# EAGLE design MODUL_TEMPERATURE_V100 (EAGLE 6.4)
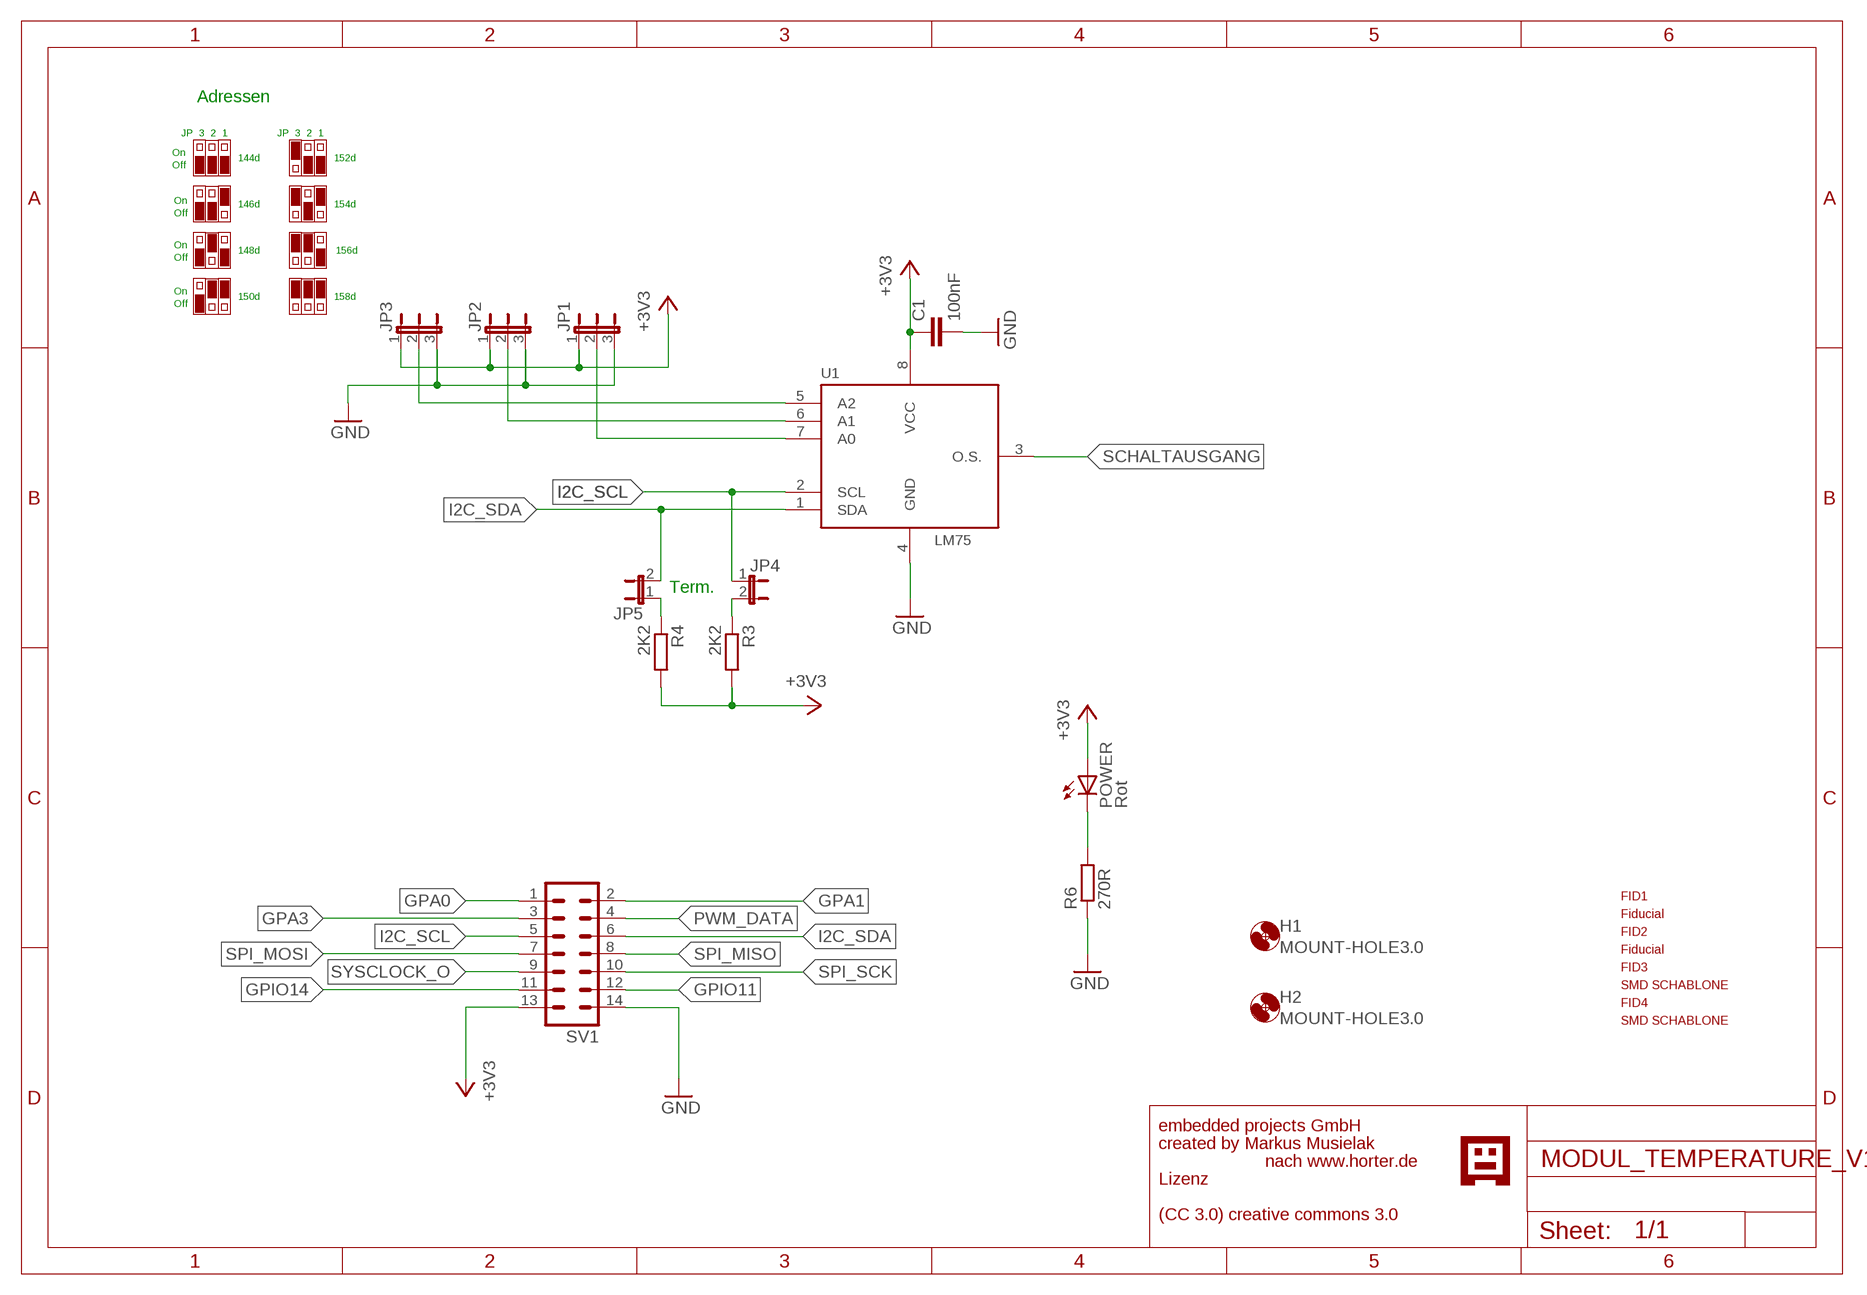
[diagram p0: schematic, sheet 1]

## Parts
C1  100nF  C-EUC0805  [C0805]
FID1  PASSERMARKEN_FIDUCIAL  [PASSERMARKEN_FIDUCIAL]
FID2  PASSERMARKEN_FIDUCIAL  [PASSERMARKEN_FIDUCIAL]
FID3  PASSERMARKEN_FIDUCIAL  [PASSERMARKEN_FIDUCIAL]
FID4  PASSERMARKEN_FIDUCIAL  [PASSERMARKEN_FIDUCIAL]
H1  MOUNT-HOLE3.0  [3,0]
H2  MOUNT-HOLE3.0  [3,0]
JP1  JP2E  [JP2]
JP2  JP2E  [JP2]
JP3  JP2E  [JP2]
JP4  JP1E  [JP1]
JP5  JP1E  [JP1]
POWER  Rot  LEDCHIP-LED0805  [CHIP-LED0805]
R3  2K2  R-EU_R0805  [R0805]
R4  2K2  R-EU_R0805  [R0805]
R6  270R  R-EU_R0805  [R0805]
SV1  ML14  [ML14]
U1  LM75  [SO-8]
U$1  GNUBLINLOGOSIEB  [GNUSIEBDRUCK]

## Nets
+3V3: C1.1 JP1.1 JP2.1 JP3.1 POWER.A R3.2 R4.2 SV1.13 U1.8(VCC)
GND: C1.2 JP1.3 JP2.3 JP3.3 R6.1 SV1.14 U1.4(GND)
GPA0: SV1.1
GPA1: SV1.2
GPA3: SV1.3
GPIO11: SV1.12
GPIO14: SV1.11
I2C_SCL: JP4.1 SV1.5 U1.2(SCL)
I2C_SDA: JP5.2 SV1.6 U1.1(SDA)
N$1: JP1.2 U1.7(A0)
N$2: JP2.2 U1.6(A1)
N$3: JP3.2 U1.5(A2)
N$6: JP4.2 R3.1
N$7: JP5.1 R4.1
N$9: POWER.C R6.2
PWM_DATA: SV1.4
SCHALTAUSGANG: U1.3(O.S.)
SPI_MISO: SV1.8
SPI_MOSI: SV1.7
SPI_SCK: SV1.10
SYSCLOCK_O: SV1.9

## Notes on the sheet
- Adressen
- JP  3  2  1 | JP  3  2  1
- On
- 144d | 152d
- Off
- On
- 146d | 154d
- Off
- On
- 148d | 156d
- Off
- On
- 150d | 158d
- Off
- Term.
- embedded projects GmbH
- created by Markus Musielak
- nach www.horter.de
- Lizenz
- (CC 3.0) creative commons 3.0

## Library data of the parts
C1 = rcl:C-EU: CAPACITOR, European symbol
FID1 FID2 = KUBUS3:PASSERMARKEN_FIDUCIAL: SMD Passermarke
FID3 FID4 = SMDSCHABLONE:PASSERMARKEN_FIDUCIAL: SMD Passermarke
H1 H2 = holes:MOUNT-HOLE: MOUNTING HOLE with drill center marker
JP1-JP3 = jumper:JP2E: JUMPER
JP4 JP5 = jumper:JP1E: JUMPER
POWER = led:LED: LED OSRAM: - CHIPLED LG R971, LG N971, LY N971, LG Q971, LY Q971, LO R971, LY R971 LH N974, LH R974 LS Q976, LO Q976, LY Q976 LO Q996 - Hyper CHIPLED LW Q18S LB Q993, LB Q99A, LB R99A - SideLED LS A670, LO A670, LY A670, LG A670, LP A670 LB A673, LV A673, LT A673, LW A673 LH A674 LY A675 LS A676, LA A676, LO A676, LY A676, LW A676 LS A679, LY A679, LG A679 - Hyper Micro SIDELED® LS Y876, LA Y876, LO Y876, LY Y876 LT Y87S - SmartLED LW L88C, LW L88S LB L89C, LB L89S, LG L890 LS L89K, LO L89K, LY L89K LS L896, LA L896, LO L896, LY L896 - TOPLED LS T670, LO T670, LY T670, LG T670, LP T670 LSG T670, LSP T670, LSY T670, LOP T670, LYG T670 LG T671, LOG T671, LSG T671 LB T673, LV T673, LT T673, LW T673 LH T674 LS T676, LA T676, LO T676, LY T676, LB T676, LH T676, LSB T676, LW T676 LB T67C, LV T67C, LT T67C, LS T67K, LO T67K, LY T67K, LW E67C LS E67B, LA E67B, LO E67B, LY E67B, LB E67C, LV E67C, LT E67C LW T67C LS T679, LY T679, LG T679 LS T770, LO T770, LY T770, LG T770, LP T770 LB T773, LV T773, LT T773, LW T773 LH T774 LS E675, LA E675, LY E675, LS T675 LS T776, LA T776, LO T776, LY T776, LB T776 LHGB T686 LT T68C, LB T68C - Hyper Mini TOPLED® LB M676 - Mini TOPLED Santana® LG M470 LS M47K, LO M47K, LY M47K Source: http://www.osram.convergy.de LUXEON: - LUMILED® LXK2-PW12-R00, LXK2-PW12-S00, LXK2-PW14-U00, LXK2-PW14-V00 LXK2-PM12-R00, LXK2-PM12-S00, LXK2-PM14-U00 LXK2-PE12-Q00, LXK2-PE12-R00, LXK2-PE12-S00, LXK2-PE14-T00, LXK2-PE14-U00 LXK2-PB12-K00, LXK2-PB12-L00, LXK2-PB12-M00, LXK2-PB14-N00, LXK2-PB14-P00, LXK2-PB14-Q00 LXK2-PR12-L00, LXK2-PR12-M00, LXK2-PR14-Q00, LXK2-PR14-R00 LXK2-PD12-Q00, LXK2-PD12-R00, LXK2-PD12-S00 LXK2-PH12-R00, LXK2-PH12-S00 LXK2-PL12-P00, LXK2-PL12-Q00, LXK2-PL12-R00 Source: www.luxeon.com KINGBRIGHT: KA-3528ASYC Source: www.kingbright.com
R3 R4 R6 = rcl:R-EU_: RESISTOR, European symbol
SV1 = con-ml:ML14: HARTING; OC_FARNELL: unknown; OC_NEWARK: unknown
U1 = Sensors:LM75: I²C Temperatur Sensor; FARNELL: 1699380
U$1 = EmbeddedProjectsLogos2:GNUBLINLOGO

## Board
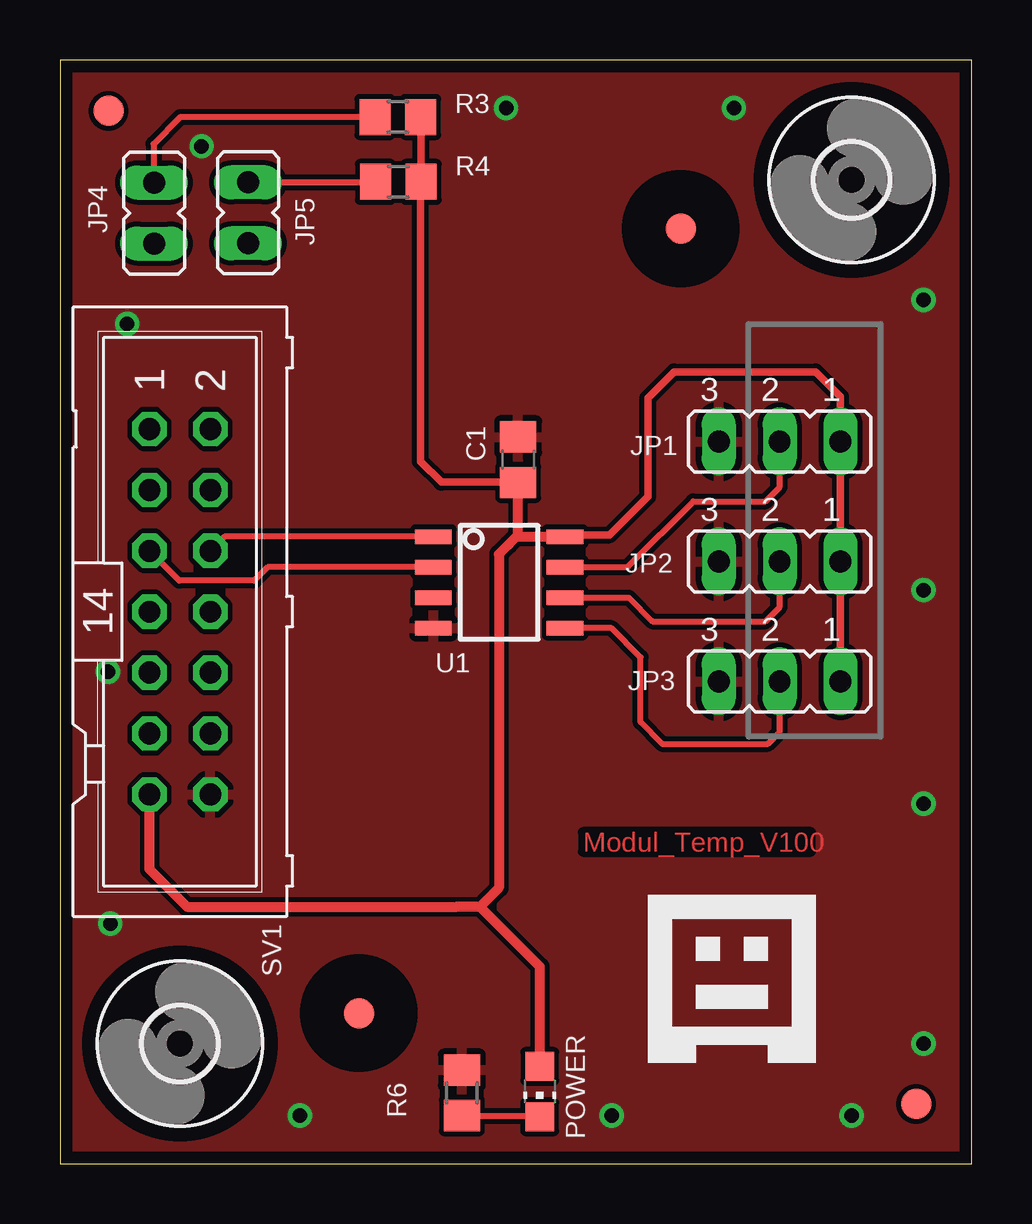
[diagram p1: board, top side]
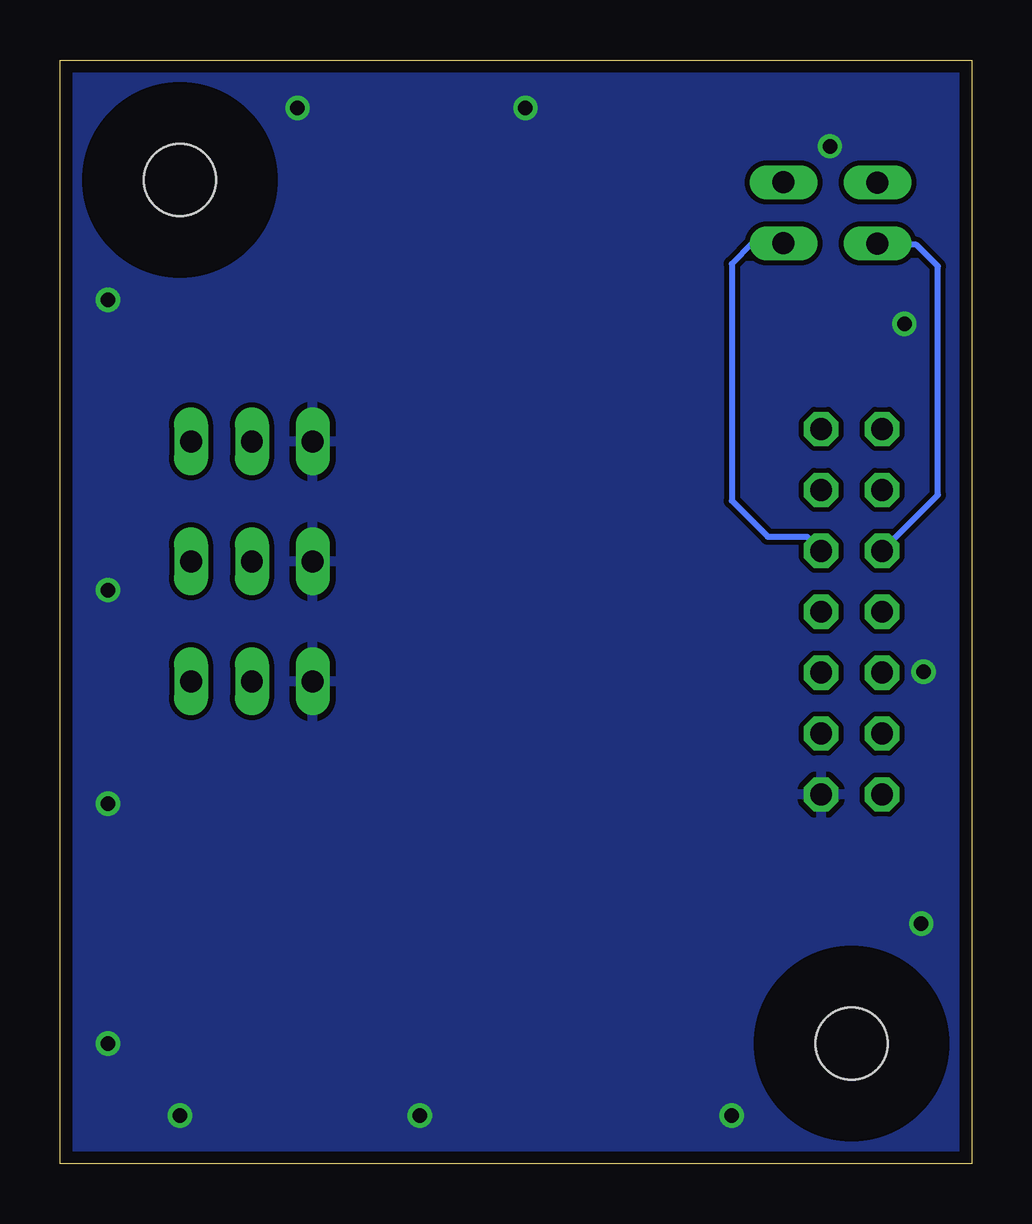
[diagram p2: board, bottom side, seen from below]

Size 38 x 46 mm. Coordinates in mm from the lower left corner, seen from the top.
Outline: 0,0 38,0 38,46 0,46 0,0
Copper layers (1*16): Top 0.035mm / dielectric 1.5mm / Bottom 0.035mm
Design rules "default *": minimum track width 10mil, minimum drill 24mil, track to track 8mil, track to pad 8mil, pad to pad 8mil, via to via 8mil, smd to smd 8mil, copper to edge 20mil, drill to drill 8mil, minimum pad ring 10mil, minimum via ring 8mil, stop-mask expansion 4mil, vias tented up to drill 40mil, thermal gap 10mil

### Footprints (pad centres in the part's own frame; a part is rotated, then mirrored left to right if it is on the bottom)
C0805 = smd 1.3 x 1.5: 1 -0.95,0; 2 0.95,0
PASSERMARKEN_FIDUCIAL = smd 1.27 x 1.27: 1 0,0
3,0 = hole 3: 0,0
JP2 = drill 0.914 long: 1 -2.54,0; 2 0,0; 3 2.54,0
JP1 = drill 0.914 long: 1 0,-1.27; 2 0,1.27
CHIP-LED0805 = smd 1.2 x 1.2: A 0,-1.05; C 0,1.05
R0805 = smd 1.3 x 1.5: 1 -0.95,0; 2 0.95,0
ML14 = drill 0.914 octagon: 1 -7.62,-1.27; 2 -7.62,1.27; 3 -5.08,-1.27; 4 -5.08,1.27; 5 -2.54,-1.27; 6 -2.54,1.27; 7 0,-1.27; 8 0,1.27; 9 2.54,-1.27; 10 2.54,1.27; 11 5.08,-1.27; 12 5.08,1.27; 13 7.62,-1.27; 14 7.62,1.27
SO-8 = smd 0.61 x 1.524: 1 -1.27,-2.743; 2 0,-2.743; 3 1.27,-2.743; 4 2.54,-2.743; 5 2.54,2.743; 6 1.27,2.743; 7 0,2.743; 8 -1.27,2.743

### Placement (x,y rotation side)
C1  19.1,29.34 90 top
FID1  12.46,6.27 0 top
FID2  25.88,38.97 0 top
FID3  2.03,43.88 0 top
FID4  35.69,2.48 0 top
H1  5,5 0 top
H2  33,41 0 top
JP1  30,30.1 180 top
JP2  30,25.1 180 top
JP3  30,20.1 180 top
JP4  3.92,39.62 0 top
JP5  7.84,39.63 180 top
POWER  20,3 180 top
R3  14.08,43.62 0 top
R4  14.1,40.92 0 top
R6  16.75,2.95 270 top
SV1  5,23 270 top
U1  18.31,24.86 270 top
U$1  24.5,4.2 0 top

### Tracks (layer width: path | path; a pad name or v marks a point on that pad's centre or on a via)
+3V3
  Top 0.254: 15.03,40.9 R4.2 | 15.05,43.6 R3.2
  Top 0.305: C1.1 18.39,28.4 15.9,28.4 15.03,29.27 15.03,40.9 | JP3.1 JP2.1 JP1.1 32.54,31.96 31.5,33 25.6,33 24.5,31.9 24.5,27.8 22.9,26.2 21.12,26.2 U1.8 | R4.2 15.05,43.6
  Top 0.406: SV1.13 3.73,12.27 5.3,10.7 16.55,10.7 17.5,10.7 | U1.8 19.03,26.13 18.7,25.8 | 18.7,25.8 18.3,25.4 18.3,11.5 17.5,10.7 | C1.1 19.1,26.2 18.7,25.8 | POWER.A 20,8.2 17.5,10.7
GND  (via drill 0.6)
  other vias: 10,2 23,2 33,2 36,5 36,15 36,23.9 36,36 28.1,44 18.6,44 2.1,10 2,20.5 2.8,35 5.9,42.4
  pour Bottom: -1.6,-2.6 40.6,-2.6 40.6,48.8 -1.7,48.8 -1.7,-2.6
  pour Top: -1.3,48.5 40.1,48.5 40.1,-2.1 -1.3,-2.1
I2C_SCL
  Top 0.254: U1.2 8.66,24.86 8.1,24.3 4.97,24.3 SV1.5
  Bottom 0.254: SV1.5 1.4,27.87 1.4,37.4 2.3,38.3 3.87,38.3 JP4.1
I2C_SDA
  Top 0.254: U1.1 6.86,26.13 SV1.6
  Bottom 0.254: JP5.2 9.14,38.36 10,37.5 10,27.63 8.5,26.13 6.86,26.13 SV1.6
N$1
  Top 0.254: U1.7 23.66,24.86 26.4,27.6 29.4,27.6 30,28.2 JP1.2
N$2
  Top 0.254: U1.6 23.71,23.59 24.7,22.6 29.4,22.6 30,23.2 JP2.2
N$3
  Top 0.254: U1.5 22.98,22.32 24.2,21.1 24.2,18.4 25.1,17.5 29.5,17.5 30,18 JP3.2
N$6
  Top 0.254: R3.1 5.02,43.62 3.9,42.5 3.9,40.91 JP4.2
N$7
  Top 0.254: JP5.1 13.13,40.9 R4.1
N$9
  Top 0.254: R6.2 19.95,2
  Top 0.305: 19.95,2 POWER.C

### Text on the board
Top: Modul_Temp_V100
tDocu: I2C-Pullup | SCL | SDA | Low | High | A0 | A1 | A2 | www.gnublin.org